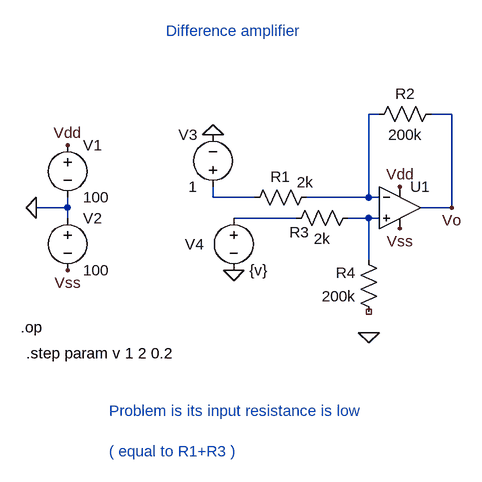
[diagram p0: schematic Difference amplifier.asc]
Difference amplifier.asc, the LTspice schematic file:
Version 4
SHEET 1 880 680
WIRE 80 16 64 16
WIRE 192 16 160 16
WIRE -176 144 -176 128
WIRE -112 144 -176 144
WIRE 64 144 64 16
WIRE 64 144 -32 144
WIRE 80 144 64 144
WIRE -400 160 -400 144
WIRE -400 160 -448 160
WIRE 192 160 192 16
WIRE 192 160 144 160
WIRE -400 176 -400 160
WIRE -48 176 -144 176
WIRE 64 176 32 176
WIRE 80 176 64 176
WIRE 64 240 64 176
FLAG 64 352 0
FLAG -448 160 0
FLAG -400 64 Vdd
FLAG -400 256 Vss
FLAG 112 192 Vss
FLAG 112 128 Vdd
FLAG -176 48 0
FLAG -144 256 0
FLAG 192 160 Vo
SYMBOL Opamps\\UniversalOpamp2 112 160 R0
SYMATTR InstName U1
SYMBOL res -16 128 R90
WINDOW 0 0 56 VBottom 2
WINDOW 3 -23 18 VTop 2
SYMATTR InstName R1
SYMATTR Value 2k
SYMBOL res 176 0 R90
WINDOW 0 0 56 VBottom 2
WINDOW 3 32 56 VTop 2
SYMATTR InstName R2
SYMATTR Value 200k
SYMBOL res 48 160 R90
WINDOW 0 53 91 VBottom 2
WINDOW 3 32 56 VTop 2
SYMATTR InstName R3
SYMATTR Value 2k
SYMBOL res 80 336 R180
WINDOW 0 36 76 Left 2
WINDOW 3 36 40 Left 2
SYMATTR InstName R4
SYMATTR Value 200k
SYMBOL voltage -400 48 R0
WINDOW 123 0 0 Left 0
WINDOW 39 0 0 Left 0
SYMATTR InstName V1
SYMATTR Value 100
SYMBOL voltage -400 160 R0
WINDOW 123 0 0 Left 0
WINDOW 39 0 0 Left 0
SYMATTR InstName V2
SYMATTR Value 100
SYMBOL voltage -176 144 R180
WINDOW 0 24 96 Left 2
WINDOW 3 24 16 Left 2
WINDOW 123 0 0 Left 0
WINDOW 39 0 0 Left 0
SYMATTR InstName V3
SYMATTR Value 1
SYMBOL voltage -144 160 R0
WINDOW 0 -75 56 Left 2
WINDOW 123 0 0 Left 0
WINDOW 39 0 0 Left 0
SYMATTR InstName V4
SYMATTR Value {v}
TEXT -472 344 Left 2 !.op
TEXT -464 384 Left 2 !.step param v 1 2 0.2
TEXT -248 -112 Left 2 ;Difference amplifier
TEXT -336 472 Left 2 ;Problem is its input resistance is low \n \n( equal to R1+R3 )

The netlist it stands for:
* Difference amplifier.asc
XU1 N004 N001 Vdd Vss Vo level.2 Avol=1Meg GBW=10Meg Slew=10Meg ilimit=25m rail=0 Vos=0 phimargin=45 en=0 enk=0 in=0 ink=0 Rin=500Meg  ; pins IN+ IN- V+ V- OUT
R1 N001 N002 2k
R2 Vo N001 200k
R3 N004 N003 2k
R4 NC_01 N004 200k
V1 Vdd 0 100
V2 0 Vss 100
V3 N002 0 1
V4 N003 0 {v}
.op
.step param v 1 2 0.2
* Difference amplifier
* Problem is its input resistance is low
* ( equal to R1+R3 )
.lib UniversalOpamps2.sub
.backanno
.end